# Altium schematic sheet PG04_Communications.SchDoc
size A4
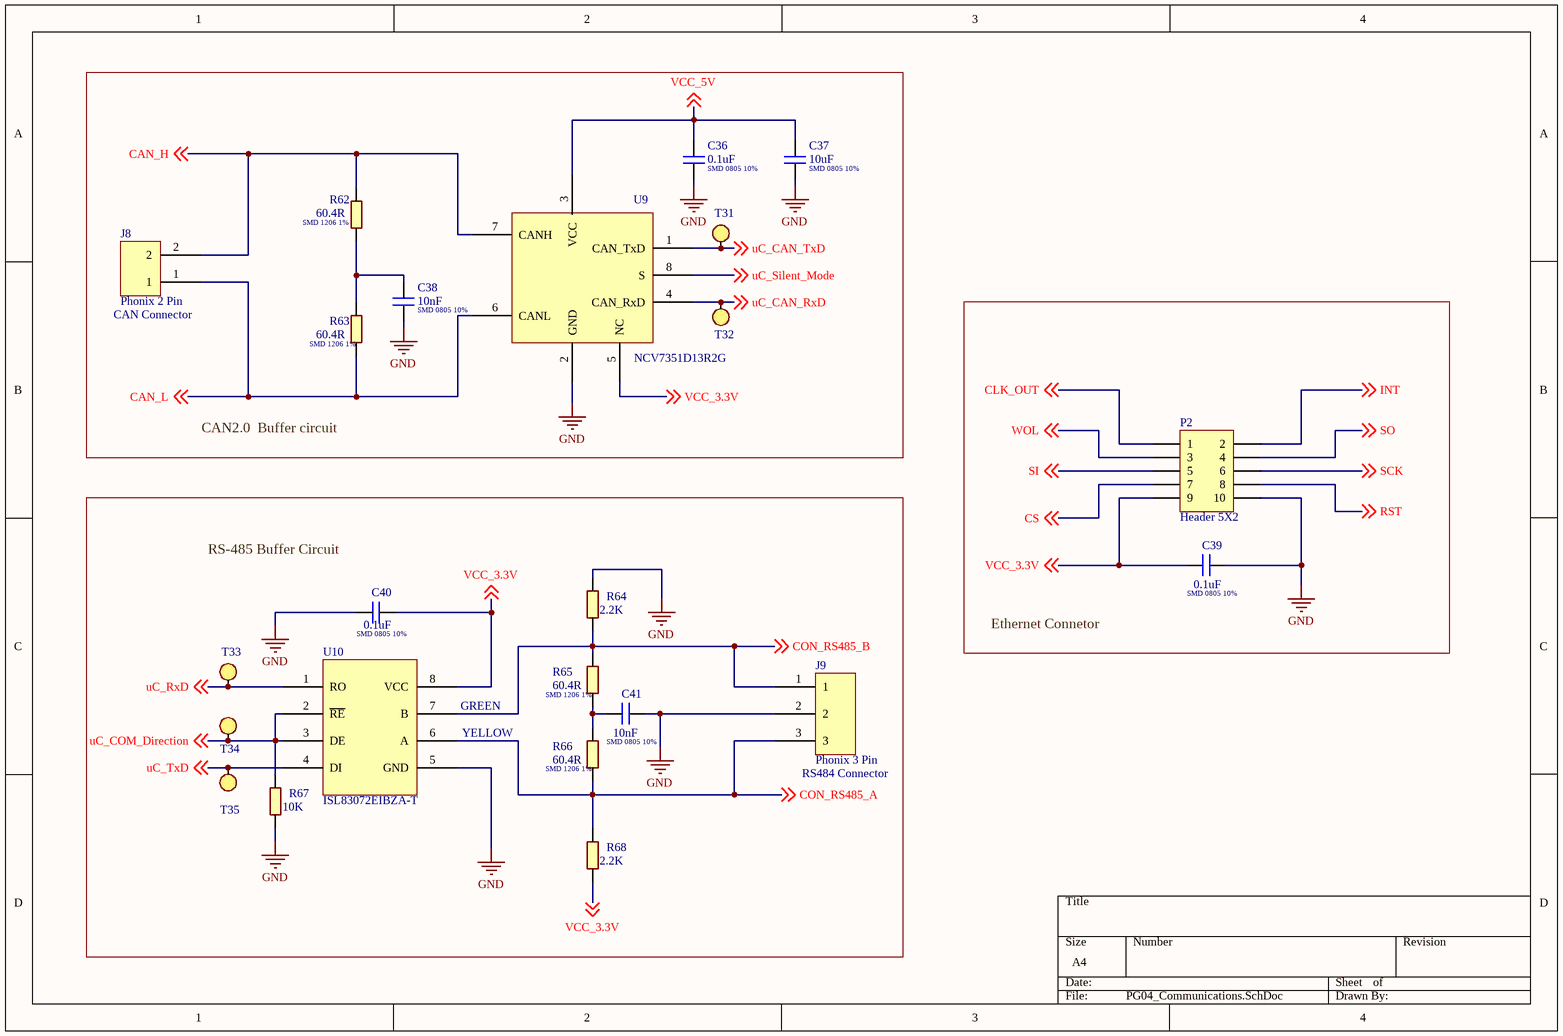
[diagram p0: PG04_Communications.SchDoc]

## Parts
C36  SMD 0805 10%  value 0.1uF  [SMD0805]
C37  SMD 0805 10%  value 10uF  [SMD0805]
C38  SMD 0805 10%  value 10nF  [SMD0805]
C39  SMD 0805 10%  value 0.1uF  [SMD0805]
C40  SMD 0805 10%  value 0.1uF  [SMD0805]
C41  SMD 0805 10%  value 10nF  [SMD0805]
J8  Phonix 2 Pin  [PHONIX2]
J9  Phonix 3 Pin  [Phonix_3]
P2  Header 5X2  [HDR2X5]
R62  SMD 1206 1%  value 60.4R  [SMD1206]
R63  SMD 1206 1%  value 60.4R  [SMD1206]
R64  value 2.2K  [SMD1206]  (hidden comment: SMD 1206 1%)
R65  SMD 1206 1%  value 60.4R  [SMD1206]
R66  SMD 1206 1%  value 60.4R  [SMD1206]
R67  value 10K  [SMD1206]  (hidden comment: SMD 1206 1%)
R68  value 2.2K  [SMD1206]  (hidden comment: SMD 1206 1%)
T31  Through hole TestPoint  [TP]  (value not drawn)
T32  Through hole TestPoint  [TP]  (value not drawn)
T33  Through hole TestPoint  [TP]  (value not drawn)
T34  Through hole TestPoint  [TP]  (value not drawn)
T35  Through hole TestPoint  [TP]  (value not drawn)
U9  value NCV7351D13R2G  [SOIC-8]  (hidden comment: CAN Transciver)
U10  value ISL83072EIBZA-T  [SOIC-8]  (hidden comment: MAX485)

## Blocks framed on the sheet
CAN2.0  Buffer circuit: C36-C38 J8 R62 R63 T31 T32 U9
Ethernet Connetor: C39 P2
RS-485 Buffer Circuit: C40 C41 J9 R64-R68 T33-T35 U10

## Nets
GND: C36.2 C37.2 C38.2 C39.2 C40.1 C41.2 J9.2 P2.10 R64.2 R67.1 U9.2(GND) U10.5(GND)
CAN_H: J8.2 R62.1 U9.7(CANH) ; off-sheet CAN_H
CAN_L: J8.1 R63.2 U9.6(CANL) ; off-sheet CAN_L
CLK_OUT: P2.1 ; off-sheet CLK_OUT
CON_RS485_A: J9.3 R66.2 R68.2 U10.6(A) ; off-sheet CON_RS485_A
CON_RS485_B: J9.1 R64.1 R65.1 U10.7(B) ; off-sheet CON_RS485_B
CS: P2.7 ; off-sheet CS
INT: P2.2 ; off-sheet INT
RST: P2.8 ; off-sheet RST
SCK: P2.6 ; off-sheet SCK
SI: P2.5 ; off-sheet SI
SO: P2.4 ; off-sheet SO
uC_CAN_RxD: T32.1 U9.4(CAN_RxD) ; off-sheet uC_CAN_RxD
uC_CAN_TxD: T31.1 U9.1(CAN_TxD) ; off-sheet uC_CAN_TxD
uC_COM_Direction: R67.2 T34.1 U10.2(~{RE}) U10.3(DE) ; off-sheet uC_COM_Direction
uC_RxD: T33.1 U10.1(RO) ; off-sheet uC_RxD
uC_Silent_Mode: U9.8(S) ; off-sheet uC_Silent_Mode
uC_TxD: T35.1 U10.4(DI) ; off-sheet uC_TxD
VCC_3.3V: C39.1 C40.2 P2.9 R68.1 U9.5(NC) U10.8(VCC) ; off-sheet VCC_3.3V
VCC_5V: C36.1 C37.1 U9.3(VCC) ; off-sheet VCC_5V
WOL: P2.3 ; off-sheet WOL
NetC38_1: C38.1 R62.2 R63.1
NetC41_1: C41.1 R65.2 R66.1

## Notes on the sheet
- (near J8) CAN Connector
- (near U10) GREEN
- (near U10) YELLOW
- (near J9) RS484 Connector

## Library data of the parts
C36-C41 = CAP_SMD: Manufacturer: Vishay
J8 = Phonix_2_Pin
J9 = Phonix_3_Pin
P2 = Header 5X2: Header, 5-Pin, Dual row; LatestRevisionDate: 17-Jul-2002; LatestRevisionNote: Re-released for DXP Platform.; Publisher: Altium Limited
R62-R68 = RES_SMD: Manufacturer: Vishay; Description: SMD1206  1% Resistor
T31-T35 = TestPoint_TH: Value: TP
U9 = NCV7351: Manufacturer: Onsemi; SPN: *
U10 = MAX485: Manufacturer: Maxim